# EAGLE design esp12-adapter (EAGLE 9.1.0)
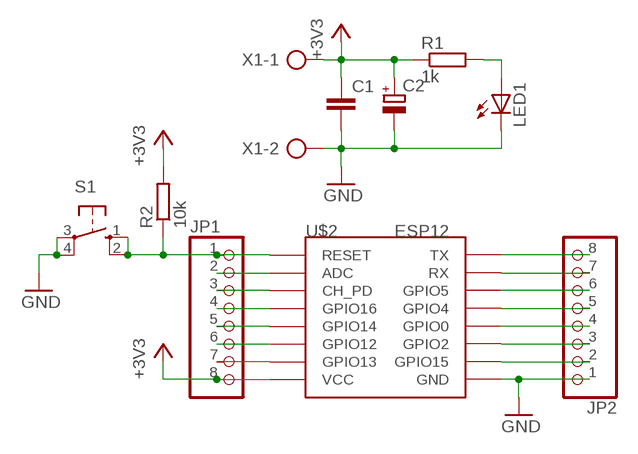
[diagram p0: schematic, sheet 1]

## Parts
C1  C-EU025-025X050  [C025-025X050]
C2  CPOL-EUE3.5-10  [E3,5-10]
JP1  PINHD-1X8  [1X08]
JP2  PINHD-1X8  [1X08]
LED1  LED5MM  [LED5MM]
R1  1k  R-EU_R1206  [R1206]
R2  10k  R-EU_R1206  [R1206]
S1  10-XX  [B3F-10XX]
U$2  ESP12  [ESP12]
X1  AK300/2  [AK300/2]

## Nets
+3V3: C1.1 C2.+ JP1.8 R1.1 R2.2 U$2.VCC X1.1
GND: C1.2 C2.- JP2.1 LED1.K(C) S1.3(P) S1.4(P1) U$2.GND X1.2
N$1: JP1.1 R2.1 S1.1(S) S1.2(S1) U$2.RESET
N$2: JP1.2 U$2.ADC
N$3: JP1.3 U$2.CH_PD
N$4: JP1.4 U$2.GPIO16
N$5: JP1.5 U$2.GPIO14
N$6: JP1.6 U$2.GPIO12
N$7: JP1.7 U$2.GPIO13
N$9: JP2.8 U$2.TX
N$10: JP2.7 U$2.RX
N$11: JP2.6 U$2.GPIO4(GPIO5)
N$12: JP2.5 U$2.GPIO5(GPIO4)
N$13: JP2.4 U$2.GPIO0
N$14: JP2.3 U$2.GPIO2
N$15: JP2.2 U$2.GPIO15
N$18: LED1.A R1.2

## Library data of the parts
C1 = rcl:C-EU: CAPACITOR, European symbol; SPICEPREFIX: C
C2 = rcl:CPOL-EU: POLARIZED CAPACITOR, European symbol; SPICEPREFIX: C
JP1 JP2 = pinhead:PINHD-1X8: PIN HEADER
LED1 = led:LED: LED OSRAM: - CHIPLED LG R971, LG N971, LY N971, LG Q971, LY Q971, LO R971, LY R971 LH N974, LH R974 LS Q976, LO Q976, LY Q976 LO Q996 - Hyper CHIPLED LW Q18S LB Q993, LB Q99A, LB R99A - SideLED LS A670, LO A670, LY A670, LG A670, LP A670 LB A673, LV A673, LT A673, LW A673 LH A674 LY A675 LS A676, LA A676, LO A676, LY A676, LW A676 LS A679, LY A679, LG A679 - Hyper Micro SIDELED® LS Y876, LA Y876, LO Y876, LY Y876 LT Y87S - SmartLED LW L88C, LW L88S LB L89C, LB L89S, LG L890 LS L89K, LO L89K, LY L89K LS L896, LA L896, LO L896, LY L896 - TOPLED LS T670, LO T670, LY T670, LG T670, LP T670 LSG T670, LSP T670, LSY T670, LOP T670, LYG T670 LG T671, LOG T671, LSG T671 LB T673, LV T673, LT T673, LW T673 LH T674 LS T676, LA T676, LO T676, LY T676, LB T676, LH T676, LSB T676, LW T676 LB T67C, LV T67C, LT T67C, LS T67K, LO T67K, LY T67K, LW E67C LS E67B, LA E67B, LO E67B, LY E67B, LB E67C, LV E67C, LT E67C LW T67C LS T679, LY T679, LG T679 LS T770, LO T770, LY T770, LG T770, LP T770 LB T773, LV T773, LT T773, LW T773 LH T774 LS E675, LA E675, LY E675, LS T675 LS T776, LA T776, LO T776, LY T776, LB T776 LHGB T686 LT T68C, LB T68C - Hyper Mini TOPLED® LB M676 - Mini TOPLED Santana® LG M470 LS M47K, LO M47K, LY M47K Source: http://www.osram.convergy.de LUXEON: - LUMILED® LXK2-PW12-R00, LXK2-PW12-S00, LXK2-PW14-U00, LXK2-PW14-V00 LXK2-PM12-R00, LXK2-PM12-S00, LXK2-PM14-U00 LXK2-PE12-Q00, LXK2-PE12-R00, LXK2-PE12-S00, LXK2-PE14-T00, LXK2-PE14-U00 LXK2-PB12-K00, LXK2-PB12-L00, LXK2-PB12-M00, LXK2-PB14-N00, LXK2-PB14-P00, LXK2-PB14-Q00 LXK2-PR12-L00, LXK2-PR12-M00, LXK2-PR14-Q00, LXK2-PR14-R00 LXK2-PD12-Q00, LXK2-PD12-R00, LXK2-PD12-S00 LXK2-PH12-R00, LXK2-PH12-S00 LXK2-PL12-P00, LXK2-PL12-Q00, LXK2-PL12-R00 Source: www.luxeon.com KINGBRIGHT: KA-3528ASYC Source: www.kingbright.com
R1 R2 = rcl:R-EU_: RESISTOR, European symbol; SPICEPREFIX: R
S1 = switch-omron:10-XX: OMRON SWITCH; MPN: B3F-1000; OC_FARNELL: 176432; OC_NEWARK: 36M3542
U$2 = esp826612q:ESP12
X1 = con-ptr500:AK300/2: CONNECTOR; OC_FARNELL: unknown; OC_NEWARK: unknown

## Board
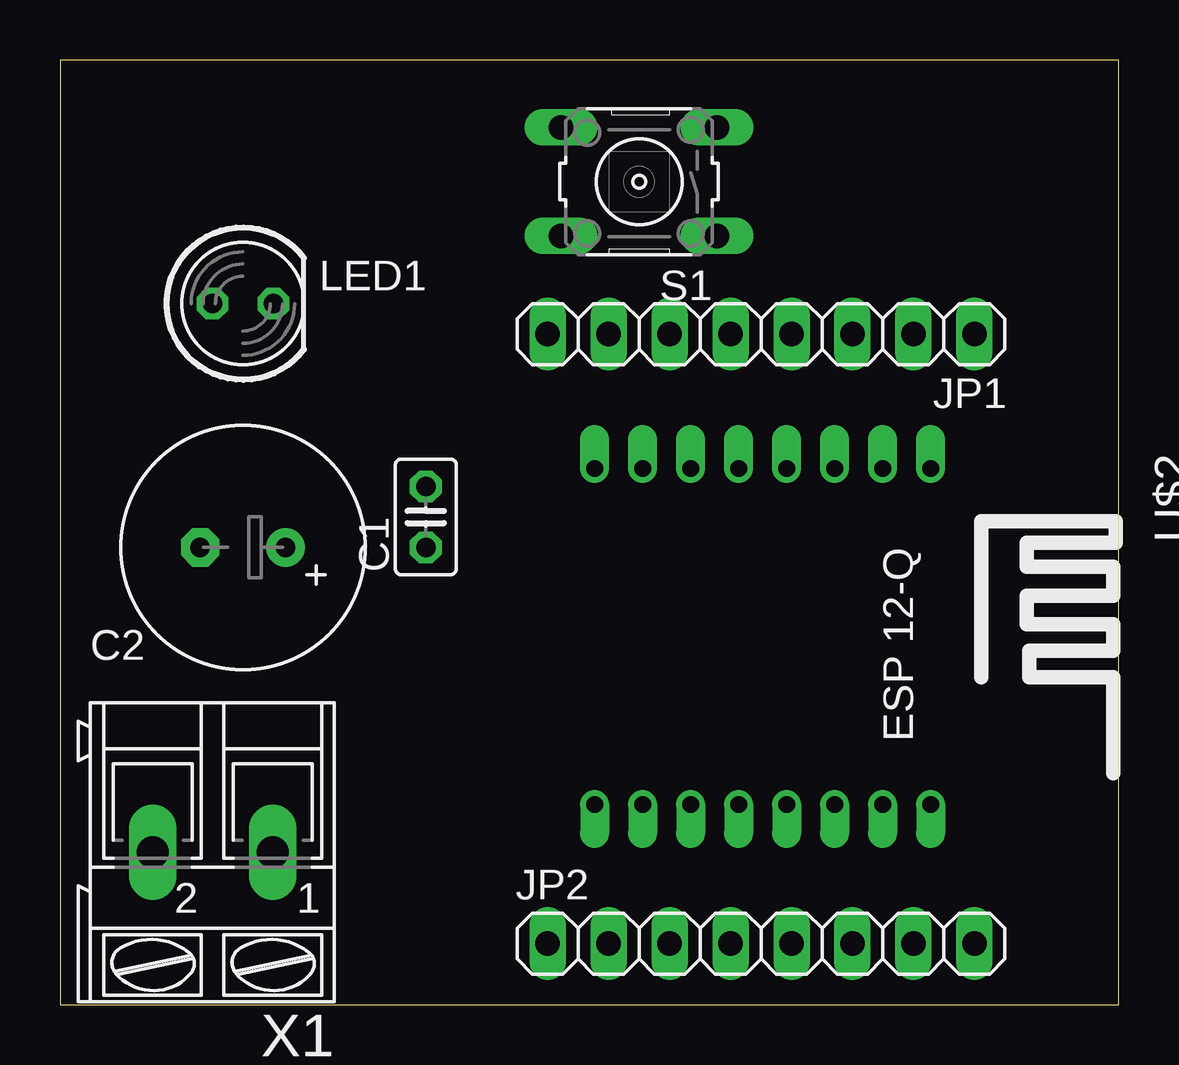
[diagram p1: board, top side]
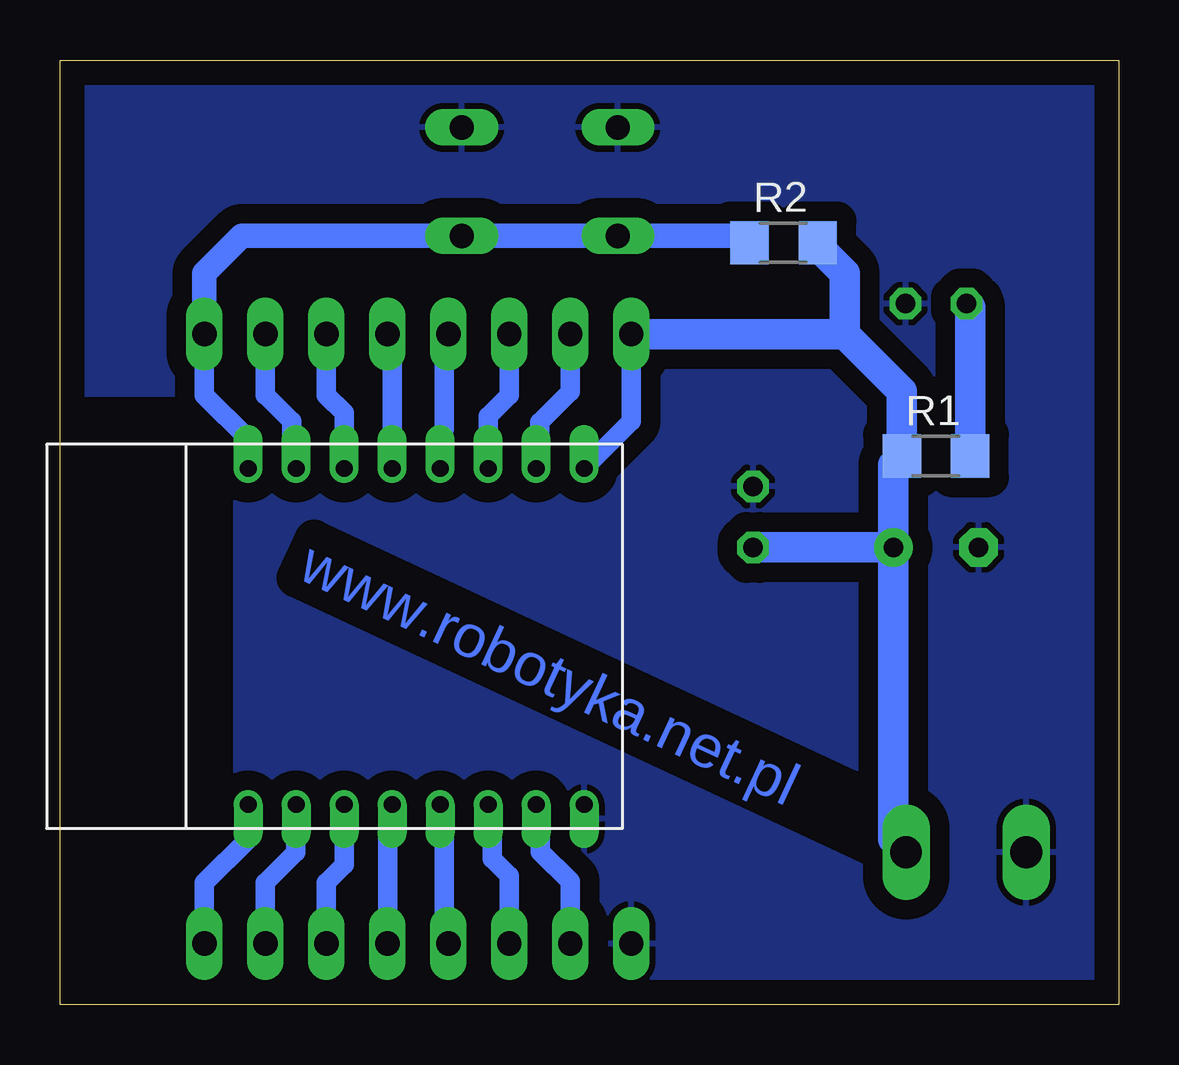
[diagram p2: board, bottom side, seen from below]

Size 44.12 x 39.36 mm. Coordinates in mm from the lower left corner, seen from the top.
Outline: 0,0 44.12,0 44.12,39.36 0,39.36 0,0
Copper layers (1*16): Top 0.035mm / dielectric 1.5mm / Bottom 0.035mm
Design rules "default *": minimum track width 6mil, minimum drill 0.35mm, track to track 32mil, track to pad 32mil, pad to pad 6mil, via to via 6mil, smd to smd 6mil, copper to edge 40mil, drill to drill 6mil, minimum pad ring 10mil, minimum via ring 8mil, stop-mask expansion 4mil, vias tented up to drill 0mil, thermal gap 10mil

### Footprints (pad centres in the part's own frame; a part is rotated, then mirrored left to right if it is on the bottom)
C025-025X050 = drill 0.813 octagon: 1 -1.27,0; 2 1.27,0
E3,5-10 = drill 0.813 pad 1.6: + -1.778,0 | drill 0.813 pad 1.6 octagon: - 1.778,0
1X08 = drill 1.016 long: 1 -8.89,0; 2 -6.35,0; 3 -3.81,0; 4 -1.27,0; 5 1.27,0; 6 3.81,0; 7 6.35,0; 8 8.89,0
LED5MM = drill 0.813 octagon: A -1.27,0; K 1.27,0
R1206 = smd 1.6 x 1.803: 1 -1.422,0; 2 1.422,0
B3F-10XX = drill 1.016 long: 1 -3.251,2.261; 2 3.251,2.261; 3 -3.251,-2.261; 4 3.251,-2.261
ESP12 = drill 0.7 offset: ADC -7.1,3.8; CH_PD -7.1,1.8; GND 6.9,-8.2; GPIO0 6.9,-2.2; GPIO2 6.9,-4.2; GPIO4 6.9,1.8; GPIO5 6.9,-0.2; GPIO12 -7.1,-4.2; GPIO13 -7.1,-6.2; GPIO14 -7.1,-2.2; GPIO15 6.9,-6.2; GPIO16 -7.1,-0.2; RESET -7.1,5.8; RX 6.9,3.8; TX 6.9,5.8; VCC -7.1,-8.2
AK300/2 = drill 1.321 long: 1 -2.515,0; 2 2.489,0

### Placement (x,y rotation side)
C1  15.24,20.32 90 top
C2  7.62,19.05 180 top
JP1  29.21,27.94 180 top
JP2  29.21,2.54 0 top
LED1  7.62,29.21 0 top
R1  7.62,22.86 0 bottom
R2  13.97,31.75 0 bottom
S1  24.13,34.29 180 top
U$2  30.48,15.24 270 top
X1  6.35,6.35 180 top

### Tracks (layer width: path | path; a pad name or v marks a point on that pad's centre or on a via)
+3V3
  Bottom 0.813: U$2.VCC 20.32,24.3 JP1.8
  Bottom 1.27: X1.1 9.4,6.88 C2.+ | 11.43,27.94 JP1.8 | R2.2 12.55,31.6 11.43,30.48 11.43,27.94 | C2.+ 9.4,22.5 R1.1 9.04,25.55 11.43,27.94 | C2.+ C1.1
GND
  pour Bottom: 0,39.37 44.45,39.37 44.45,25.4 36.83,25.4 36.83,7.62 44.45,7.62 44.45,0 0,0
N$1
  Bottom 0.813: JP1.1 38.1,25.4 36.28,23.58 U$2.RESET
  Bottom 1.016: JP1.1 38.1,30.48 36.55,32.03 S1.1 S1.2 15.67,32.03 R2.1
N$2
  Bottom 0.813: U$2.ADC 34.46,22.52 34.46,24.3 35.52,25.37 35.53,25.37 35.56,25.4 JP1.2
N$3
  Bottom 0.813: U$2.CH_PD 32.28,24.66 33.02,25.4 JP1.3
N$4
  Bottom 0.813: U$2.GPIO16 30.28,27.74 JP1.4
N$5
  Bottom 0.813: JP1.5 27.92,27.92 27.92,28.3 28.1,28.11 28.1,23.97 28.28,23.79 U$2.GPIO14
N$6
  Bottom 0.813: U$2.GPIO12 26.28,24.52 25.4,25.4 JP1.6
N$7
  Bottom 0.813: U$2.GPIO13 24.13,22.49 24.13,24.28 22.86,25.55 JP1.7
N$9
  Bottom 0.813: U$2.TX 36.28,6.9 38.1,5.08 JP2.8
N$10
  Bottom 0.813: U$2.RX 34.29,6.35 35.56,5.08 JP2.7
N$11
  Bottom 0.813: U$2.GPIO4 32.28,5.82 33.02,5.08 JP2.6
N$12
  Bottom 0.813: JP2.5 30.46,2.57 30.46,8.16 U$2.GPIO5
N$13
  Bottom 0.813: U$2.GPIO0 28.1,8.16 28.1,2.57 28.08,2.54 JP2.4
N$14
  Bottom 0.813: JP2.3 25.4,5.38 26.1,6.08 26.1,8.16 U$2.GPIO2
N$15
  Bottom 0.813: U$2.GPIO15 24.1,8.16 24.1,6.38 22.86,5.13 JP2.2
N$18
  Bottom 1.27: LED1.A 6.2,29.06 R1.2

### Text on the board
Bottom: www.robotyka.net.pl